# Altium schematic sheet sensor.SchDoc
size A3
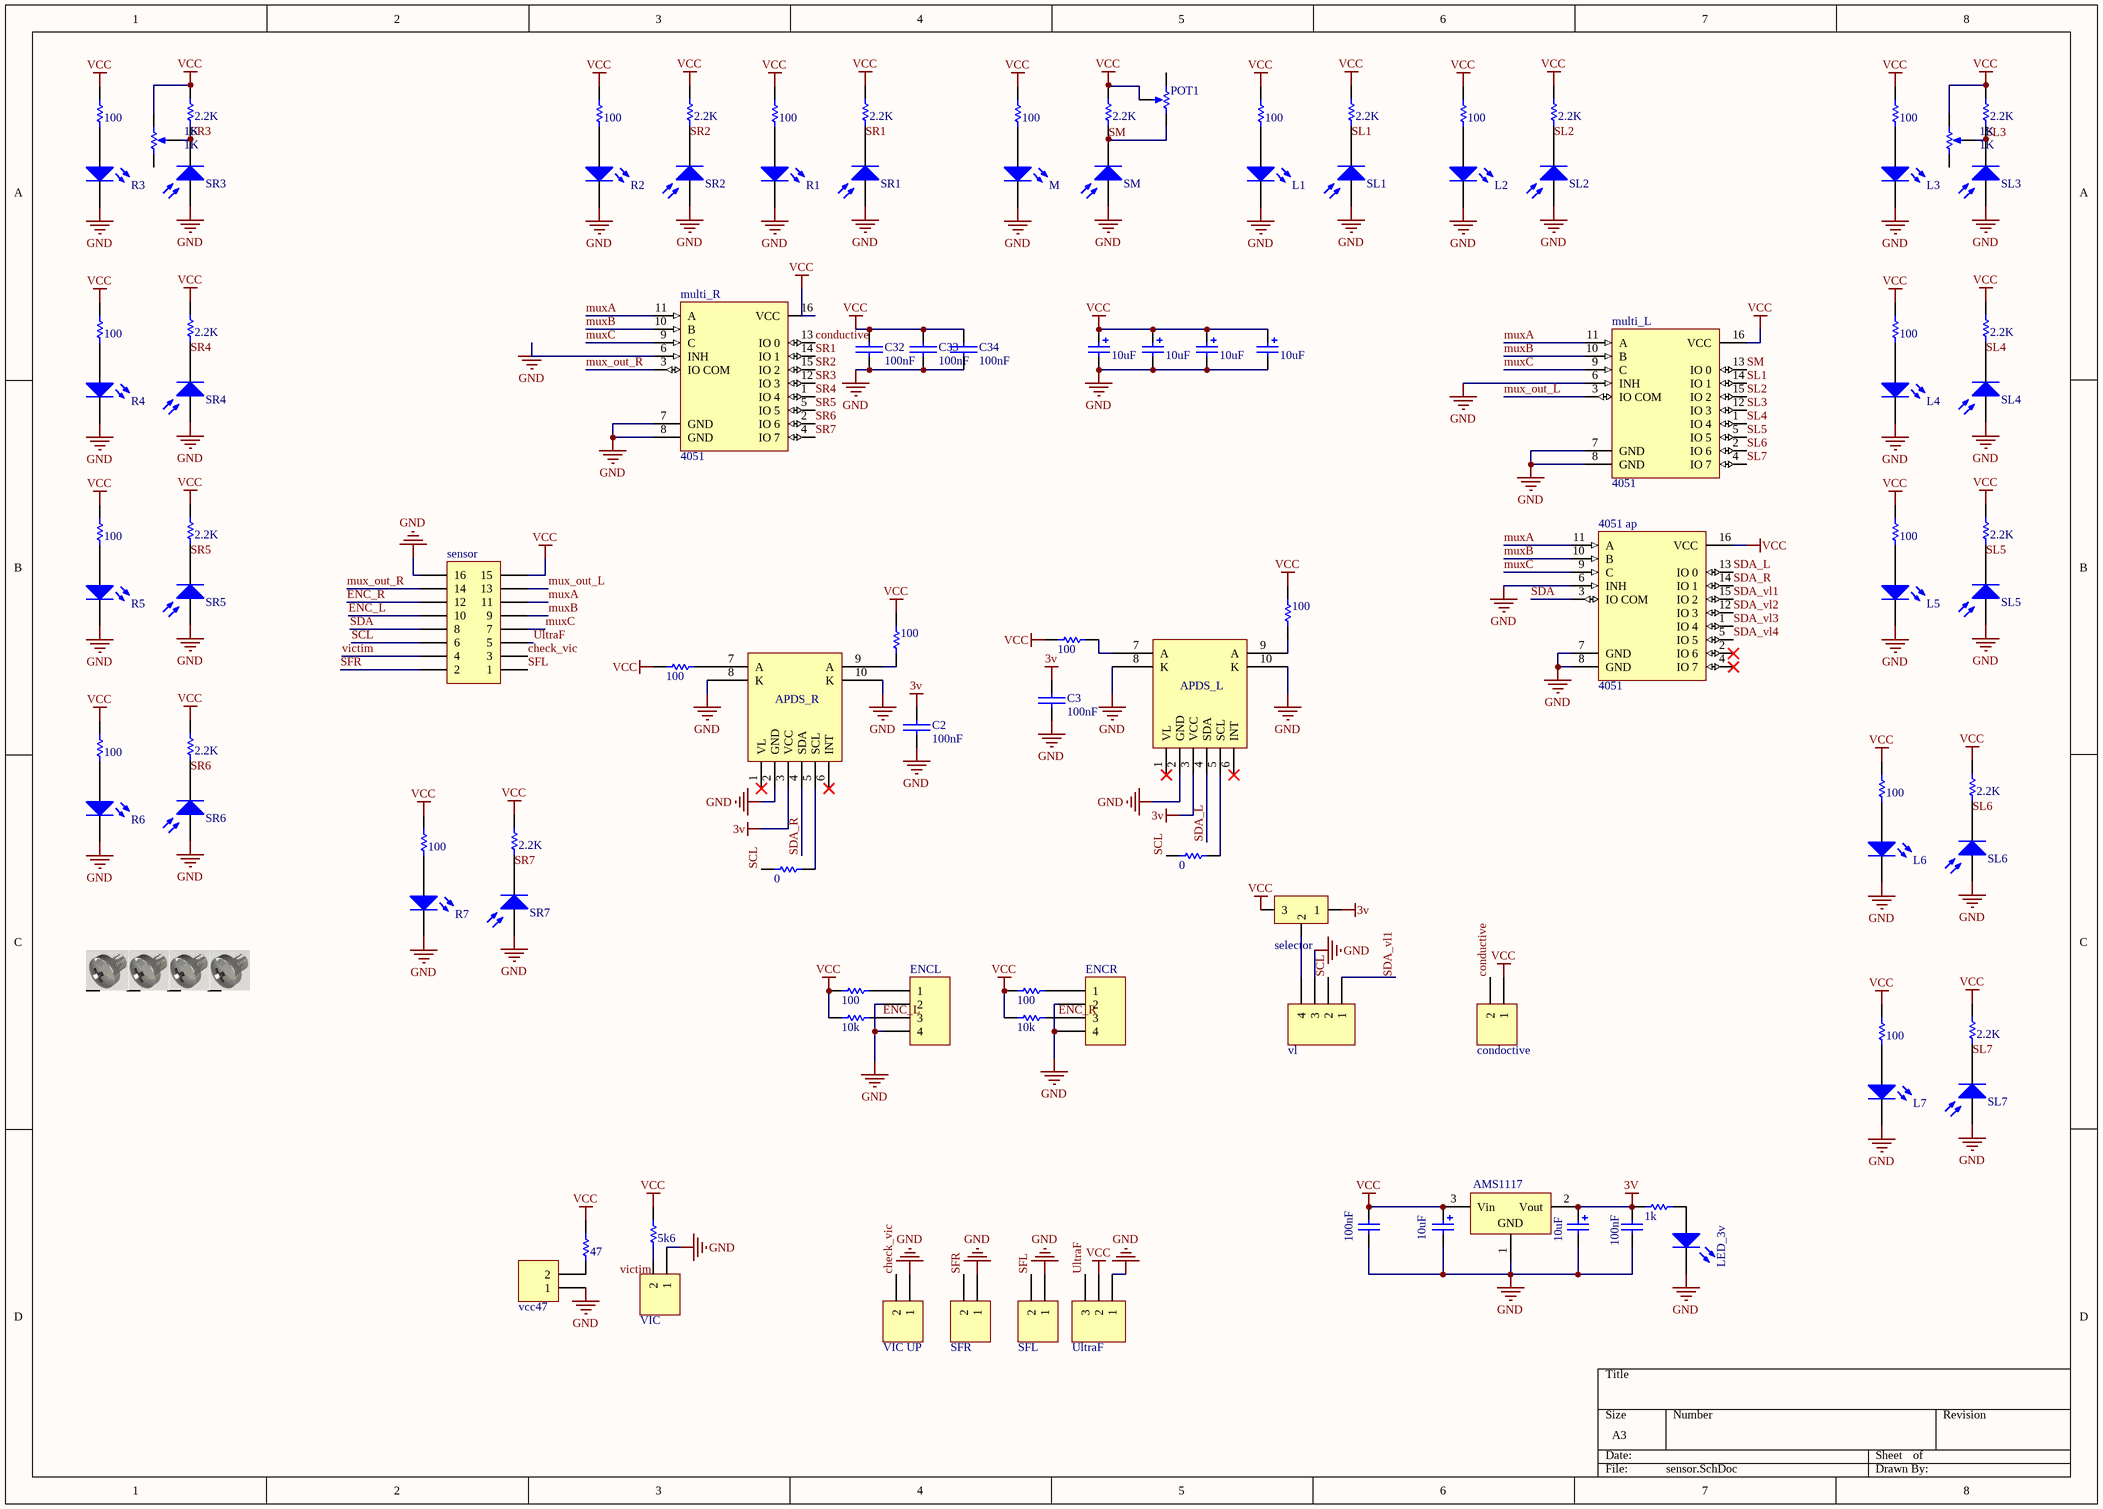
[diagram p0: sensor.SchDoc]

## Parts
444  100  [RES 0805]
4051_ap  4051  [SO-16]
?  1K  [MULTI TURN RIGHT]
APDS_L  APDS_9960_led  [APDS_9960_led]  (value not drawn)
APDS_R  APDS_9960_led  [APDS_9960_led]  (value not drawn)
C2  100nF  [SMD_CAP_0805]
C3  100nF  [SMD_CAP_0805]
c11  10uf  [CAP SMC]
c12  10uf  [CAP SMC]
C13  10uf  [CAP SMC]
C32  100nF  [SMD_CAP_0805]
C33  100nF  [SMD_CAP_0805]
C34  100nF  [SMD_CAP_0805]
C1324  value 10uF  [CAP SMC]  (hidden comment: 10nf)
C_1  100nF  [CAP 0805]
C_2  10uF  [CAP 0805]
C_3  10uF  [CAP 0805]
C_4  100nF  [CAP 0805]
condoctive  CON 2  [CON M 2]  (value not drawn)
dd  Screw  [Board Screw]  (value not drawn)
dddd  Screw  [Board Screw]  (value not drawn)
ENCL  CON 4  [CON M 4]  (value not drawn)
ENCR  CON 4  [CON M 4]  (value not drawn)
jump1  0  [RES 0805]
jump2  0  [RES 0805]
L1  IR send  [IR 3 send]  (value not drawn)
L2  IR send  [IR 3 send]  (value not drawn)
L3  IR send  [IR 3 send]  (value not drawn)
L4  IR send  [IR 3 send]  (value not drawn)
L5  IR send  [IR 3 send]  (value not drawn)
L6  IR send  [IR 3 send]  (value not drawn)
L7  IR send  [IR 3 send]  (value not drawn)
LED_3v  LED  [LED 1206]  (value not drawn)
M  IR send  [IR 3 send]  (value not drawn)
multi_L  4051  [SO-16]
multi_R  4051  [SO-16]
p?  Screw  [Board Screw]  (value not drawn)
p?d  Screw  [Board Screw]  (value not drawn)
POT1  10K  [MULTI TURN RIGHT]  (value not drawn)
R  1K  [MULTI TURN RIGHT]
R1  IR send  [IR 3 send]  (value not drawn)
R2  IR send  [IR 3 send]  (value not drawn)
R3  IR send  [IR 3 send]  (value not drawn)
R4  IR send  [IR 3 send]  (value not drawn)
R5  IR send  [IR 3 send]  (value not drawn)
r5k6  5k6  [RES 0805]
R6  IR send  [IR 3 send]  (value not drawn)
R7  IR send  [IR 3 send]  (value not drawn)
R13  100  [RES 0805]
R15  100  [RES 0805]
R33  100  [RES 0805]
r47  47  [RES 0805]
R133  100  [RES 0805]
R144  10k  [RES 0805]
R222  10k  [RES 0805]
R2444  100  [RES 0805]
R_?  1k  [RES 0805]
REG?  AMS1117  [AMS1117]
RL1  100  [RES 0805]
RL2  100  [RES 0805]
RL3  100  [RES 0805]
RL4  100  [RES 0805]
RL5  100  [RES 0805]
RL6  100  [RES 0805]
RL7  100  [RES 0805]
RM  100  [RES 0805]
RR1  100  [RES 0805]
RR2  100  [RES 0805]
RR3  100  [RES 0805]
RR4  100  [RES 0805]
RR5  100  [RES 0805]
RR6  100  [RES 0805]
RR7  100  [RES 0805]
RSL1  2.2K  [RES 0805]
RSL2  2.2K  [RES 0805]
RSL3  2.2K  [RES 0805]
RSL4  2.2K  [RES 0805]
RSL5  2.2K  [RES 0805]
RSL6  2.2K  [RES 0805]
RSL7  2.2K  [RES 0805]
RSM  2.2K  [RES 0805]
RSR1  2.2K  [RES 0805]
RSR2  2.2K  [RES 0805]
RSR3  2.2K  [RES 0805]
RSR4  2.2K  [RES 0805]
RSR5  2.2K  [RES 0805]
RSR6  2.2K  [RES 0805]
RSR7  2.2K  [RES 0805]
selector  selector  [selector]  (value not drawn)
sensor  2*8  [CON IDC 2X8]  (value not drawn)
SFL  CON 2  [CON M 2]  (value not drawn)
SFR  CON 2  [CON M 2]  (value not drawn)
SL1  IR rec  [IR 3 rec]  (value not drawn)
SL2  IR rec  [IR 3 rec]  (value not drawn)
SL3  IR rec  [IR 3 rec]  (value not drawn)
SL4  IR rec  [IR 3 rec]  (value not drawn)
SL5  IR rec  [IR 3 rec]  (value not drawn)
SL6  IR rec  [IR 3 rec]  (value not drawn)
SL7  IR rec  [IR 3 rec]  (value not drawn)
SM  IR rec  [IR 3 rec]  (value not drawn)
SR1  IR rec  [IR 3 rec]  (value not drawn)
SR2  IR rec  [IR 3 rec]  (value not drawn)
SR3  IR rec  [IR 3 rec]  (value not drawn)
SR4  IR rec  [IR 3 rec]  (value not drawn)
SR5  IR rec  [IR 3 rec]  (value not drawn)
SR6  IR rec  [IR 3 rec]  (value not drawn)
SR7  IR rec  [IR 3 rec]  (value not drawn)
UltraF  CON 3  [CON M 3]  (value not drawn)
VIC  CON 2  [CON M 2]  (value not drawn)
VIC_s  vcc47  [CON M 2]
VIC_UP  CON 2  [CON M 2]  (value not drawn)
vl  CON 4  [CON M 4]  (value not drawn)

## Nets
3v: APDS_L.3(VCC) APDS_R.3(VCC) C2.1(+) C3.1(+) C_3.1 C_4.2 R_?.1 REG?.2(Vout) selector.1
GND: 4051_ap.6(INH) 4051_ap.7(GND) 4051_ap.8(GND) APDS_L.2(GND) APDS_L.8(K) APDS_L.10(K) APDS_R.2(GND) APDS_R.8(K) APDS_R.10(K) C2.2(-) C3.2(-) c11.2 c12.2 C13.2 C32.2(-) C33.2(-) C34.2(-) C1324.2 C_1.1 C_2.2 C_3.2 C_4.1 ENCL.2 ENCL.4 ENCR.2 ENCR.4 L1.2(K) L2.2(K) L3.2(K) L4.2(K) L5.2(K) L6.2(K) L7.2(K) LED_3v.2(K) M.2(K) multi_L.6(INH) multi_L.7(GND) multi_L.8(GND) multi_R.6(INH) multi_R.7(GND) multi_R.8(GND) R1.2(K) R2.2(K) R3.2(K) R4.2(K) R5.2(K) R6.2(K) R7.2(K) REG?.1(GND) sensor.16 SFL.1 SFR.1 SL1.1(A) SL2.1(A) SL3.1(A) SL4.1(A) SL5.1(A) SL6.1(A) SL7.1(A) SM.1(A) SR1.1(A) SR2.1(A) SR3.1(A) SR4.1(A) SR5.1(A) SR6.1(A) SR7.1(A) UltraF.1 VIC.1 VIC_s.1 VIC_UP.1 vl.3
VCC: 444.1 4051_ap.16(VCC) ?.2(BOT) c11.1 c12.1 C13.1 C32.1(+) C33.1(+) C34.1(+) C1324.1 C_1.2 C_2.1 condoctive.1 multi_L.16(VCC) multi_R.16(VCC) POT1.2(TAP) R.2(BOT) r5k6.1 R13.1 R15.2 R33.2 r47.2 R133.1 R144.1 R222.1 R2444.2 REG?.3(Vin) RL1.1 RL2.1 RL3.1 RL4.1 RL5.1 RL6.1 RL7.1 RM.1 RR1.1 RR2.1 RR3.1 RR4.1 RR5.1 RR6.1 RR7.1 RSL1.1 RSL2.1 RSL3.1 RSL4.1 RSL5.1 RSL6.1 RSL7.1 RSM.1 RSR1.1 RSR2.1 RSR3.1 RSR4.1 RSR5.1 RSR6.1 RSR7.1 selector.3 sensor.15 UltraF.2
check_vic: sensor.3 VIC_UP.2
conductive: condoctive.2 multi_R.13(IO_0)
ENC_L: ENCL.3 R222.2 sensor.10
ENC_R: ENCR.3 R144.2 sensor.12
mux_out_L: multi_L.3(IO_COM) sensor.13
mux_out_R: multi_R.3(IO_COM) sensor.14
muxA: 4051_ap.11(A) multi_L.11(A) multi_R.11(A) sensor.11
muxB: 4051_ap.10(B) multi_L.10(B) multi_R.10(B) sensor.9
muxC: 4051_ap.9(C) multi_L.9(C) multi_R.9(C) sensor.7
SCL: jump1.2 jump2.2 sensor.6 vl.2
SDA: 4051_ap.3(IO_COM) sensor.8
SDA_L: 4051_ap.13(IO_0) APDS_L.4(SDA)
SDA_R: 4051_ap.14(IO_1) APDS_R.4(SDA)
SDA_vl1: 4051_ap.15(IO_2) vl.1
SDA_vl2: 4051_ap.12(IO_3)
SDA_vl3: 4051_ap.1(IO_4)
SDA_vl4: 4051_ap.5(IO_5)
SFL: sensor.1 SFL.2
SFR: sensor.2 SFR.2
SL1: multi_L.14(IO_1) RSL1.2 SL1.2(K)
SL2: multi_L.15(IO_2) RSL2.2 SL2.2(K)
SL3: multi_L.12(IO_3) R.3(TAP) RSL3.2 SL3.2(K)
SL4: multi_L.1(IO_4) RSL4.2 SL4.2(K)
SL5: multi_L.5(IO_5) RSL5.2 SL5.2(K)
SL6: multi_L.2(IO_6) RSL6.2 SL6.2(K)
SL7: multi_L.4(IO_7) RSL7.2 SL7.2(K)
SM: multi_L.13(IO_0) POT1.3(BOT) RSM.2 SM.2(K)
SR1: multi_R.14(IO_1) RSR1.2 SR1.2(K)
SR2: multi_R.15(IO_2) RSR2.2 SR2.2(K)
SR3: ?.3(TAP) multi_R.12(IO_3) RSR3.2 SR3.2(K)
SR4: multi_R.1(IO_4) RSR4.2 SR4.2(K)
SR5: multi_R.5(IO_5) RSR5.2 SR5.2(K)
SR6: multi_R.2(IO_6) RSR6.2 SR6.2(K)
SR7: multi_R.4(IO_7) RSR7.2 SR7.2(K)
UltraF: sensor.5 UltraF.3
victim: r5k6.2 sensor.4 VIC.2
Net444_2: 444.2 APDS_R.7(A)
NetAPDS_L_5: APDS_L.5(SCL) jump1.1
NetAPDS_L_7: APDS_L.7(A) R15.1
NetAPDS_L_9: APDS_L.9(A) R33.1
NetAPDS_R_5: APDS_R.5(SCL) jump2.1
NetAPDS_R_9: APDS_R.9(A) R2444.1
NetENCL_1: ENCL.1 R133.2
NetENCR_1: ENCR.1 R13.2
NetL1_1: L1.1(A) RL1.2
NetL2_1: L2.1(A) RL2.2
NetL3_1: L3.1(A) RL3.2
NetL4_1: L4.1(A) RL4.2
NetL5_1: L5.1(A) RL5.2
NetL6_1: L6.1(A) RL6.2
NetL7_1: L7.1(A) RL7.2
NetLED_3v_1: LED_3v.1(A) R_?.2
NetM_1: M.1(A) RM.2
NetR1_1: R1.1(A) RR1.2
NetR2_1: R2.1(A) RR2.2
NetR3_1: R3.1(A) RR3.2
NetR4_1: R4.1(A) RR4.2
NetR5_1: R5.1(A) RR5.2
NetR6_1: R6.1(A) RR6.2
NetR7_1: R7.1(A) RR7.2
Netr47_1: r47.1 VIC_s.2
Netselector_2: selector.2 vl.4

Not connected (* = marked no-connect by the designer): 4051_ap 2(IO_6)* 4(IO_7)*; ? 1(TOP); APDS_L 1(VL)* 6(INT)*; APDS_R 1(VL)* 6(INT)*; dd S; dddd S; p? S; p?d S; POT1 1(TOP); R 1(TOP)

## Library data of the parts
444 jump1 jump2 r5k6 R13 R15 R33 r47 R133 R2444 R_? RL1-RL7 RM RR1-RR7 RSL1-RSL7 RSM RSR1-RSR7 = Res: Resistor; Published: 8-Jun-2000; LatestRevisionDate: 17-Jul-2002; LatestRevisionNote: Re-released for DXP Platform.; PackageReference: AXIAL-0.3; Publisher: Altium Limited
  444 R13 R15 R33 R133 R2444 RL1-RL7 RM RR1-RR7: Value: 100
  jump1 jump2: Value: 0
  r5k6: Value: 5k6
  r47: Value: 47
  R_?: Value: 1k
  RSL1-RSL7 RSM RSR1-RSR7: Value: 2.2K
4051_ap multi_L multi_R = 4051: Analog Multiplexer/Demultiplexer; Published: 8-Jun-2000; LatestRevisionDate: 06-Jun-2005; LatestRevisionNote: Stylized 3D Model Added.; DatasheetVersion: Jun-1989; PackageVersion: Apr-1996; PackageReference: DIP16; Publisher: Altium Limited; PackageDescription: DIP; 16 Leads; Row Spacing 7.62 mm; Pitch 2.54 mm; ComponentLink1Description: Manufacturer Link; ComponentLink1URL: http://www.st.com/; ComponentLink2Description: Datasheet; ComponentLink2URL: http://www.st.com/stonline/products/literature/ds/2053/hcf4051.pdf
? R = Multi_turn: Potentiometer; Sim Note: Enter the Resistance value and the set point into parameter fields.; Set Position: 0.5; Published: 8-Jun-2000; LatestRevisionDate: 17-Jul-2002; LatestRevisionNote: Re-released for DXP Platform.; PackageReference: VR5; Publisher: Altium Limited; Value: 1K
APDS_L APDS_R = APDS 9960 LED: RGB color detection sensor
C2 C3 C32-C34 = Cap-Bipolar: Bipolar Capacitor; Voltage: 100V; Designer: Saeid Jorablo; Organazation: ControTec; Adding Date: 1387/12/20; Value: 100nF
c11 c12 C13 C1324 C_2 C_3 = Cap Pol1: Polarized Capacitor (Radial); Published: 8-Jun-2000; LatestRevisionDate: 17-Jul-2002; LatestRevisionNote: Re-released for DXP Platform.; PackageReference: RB7.6-15; Publisher: Altium Limited
  c11 c12 C13 C_2 C_3: Value: 10uF
C_1 C_4 = Cap: Capacitor; Published: 8-Jun-2000; LatestRevisionDate: 17-Jul-2002; LatestRevisionNote: Re-released for DXP Platform.; PackageReference: RAD-0.3; Publisher: Altium Limited; Value: 100nF
condoctive SFL SFR VIC VIC_s VIC_UP = CON 2: Header, 2-Pin; LatestRevisionDate: 17-Jul-2002; LatestRevisionNote: Re-released for DXP Platform.; Publisher: Altium Limited
dd dddd p? p?d = Board Screw: Board Screw With Spacer
ENCL ENCR vl = CON 4: Header, 4-Pin; LatestRevisionDate: 17-Jul-2002; LatestRevisionNote: Re-released for DXP Platform.; Publisher: Altium Limited
L1-L7 M R1-R7 = IR send: Photosensitive Diode; Published: 24-Mar-1999; LatestRevisionDate: 17-Jul-2002; LatestRevisionNote: Re-released for DXP Platform.; PackageReference: PIN2; Publisher: Altium Limited
LED_3v = LED: Typical INFRARED GaAs LED; Published: 8-Jun-2000; LatestRevisionDate: 08-Jul-2005; LatestRevisionNote: Mech Layer 1 removed.; PackageReference: LED-0; Publisher: Altium Limited
POT1 = RPot: Potentiometer; Sim Note: Enter the Resistance value and the set point into parameter fields.; Set Position: 0.5; Published: 8-Jun-2000; LatestRevisionDate: 17-Jul-2002; LatestRevisionNote: Re-released for DXP Platform.; PackageReference: VR5; Publisher: Altium Limited; Value: 10K
R144 R222 = Res: Resistor; Value: 1K; Published: 8-Jun-2000; LatestRevisionDate: 17-Jul-2002; LatestRevisionNote: Re-released for DXP Platform.; PackageReference: AXIAL-0.3; Publisher: Altium Limited
REG? = AMS1117: Voltage Regulator; Published: 24-Mar-1999; LatestRevisionDate: 17-Jul-2002; LatestRevisionNote: Re-released for DXP Platform.; PackageReference: D2PAK; Publisher: Altium Limited; Code_JEDEC: SMD-220
selector = selector: Header, 3-Pin; LatestRevisionDate: 17-Jul-2002; LatestRevisionNote: Re-released for DXP Platform.; Publisher: Altium Limited
sensor = Header 8X2: Header, 8-Pin, Dual row; LatestRevisionDate: 17-Jul-2002; LatestRevisionNote: Re-released for DXP Platform.; Publisher: Altium Limited
SL1-SL7 SM SR1-SR7 = IR rec: Photosensitive Diode; Published: 24-Mar-1999; LatestRevisionDate: 17-Jul-2002; LatestRevisionNote: Re-released for DXP Platform.; PackageReference: PIN2; Publisher: Altium Limited
UltraF = CON 3: CONECTOR, 3-Pin; LatestRevisionDate: 17-Jul-2002; LatestRevisionNote: Re-released for DXP Platform.; Publisher: Altium Limited